# Altium schematic sheet Hexapod_servo_AD.SchDoc
size A4
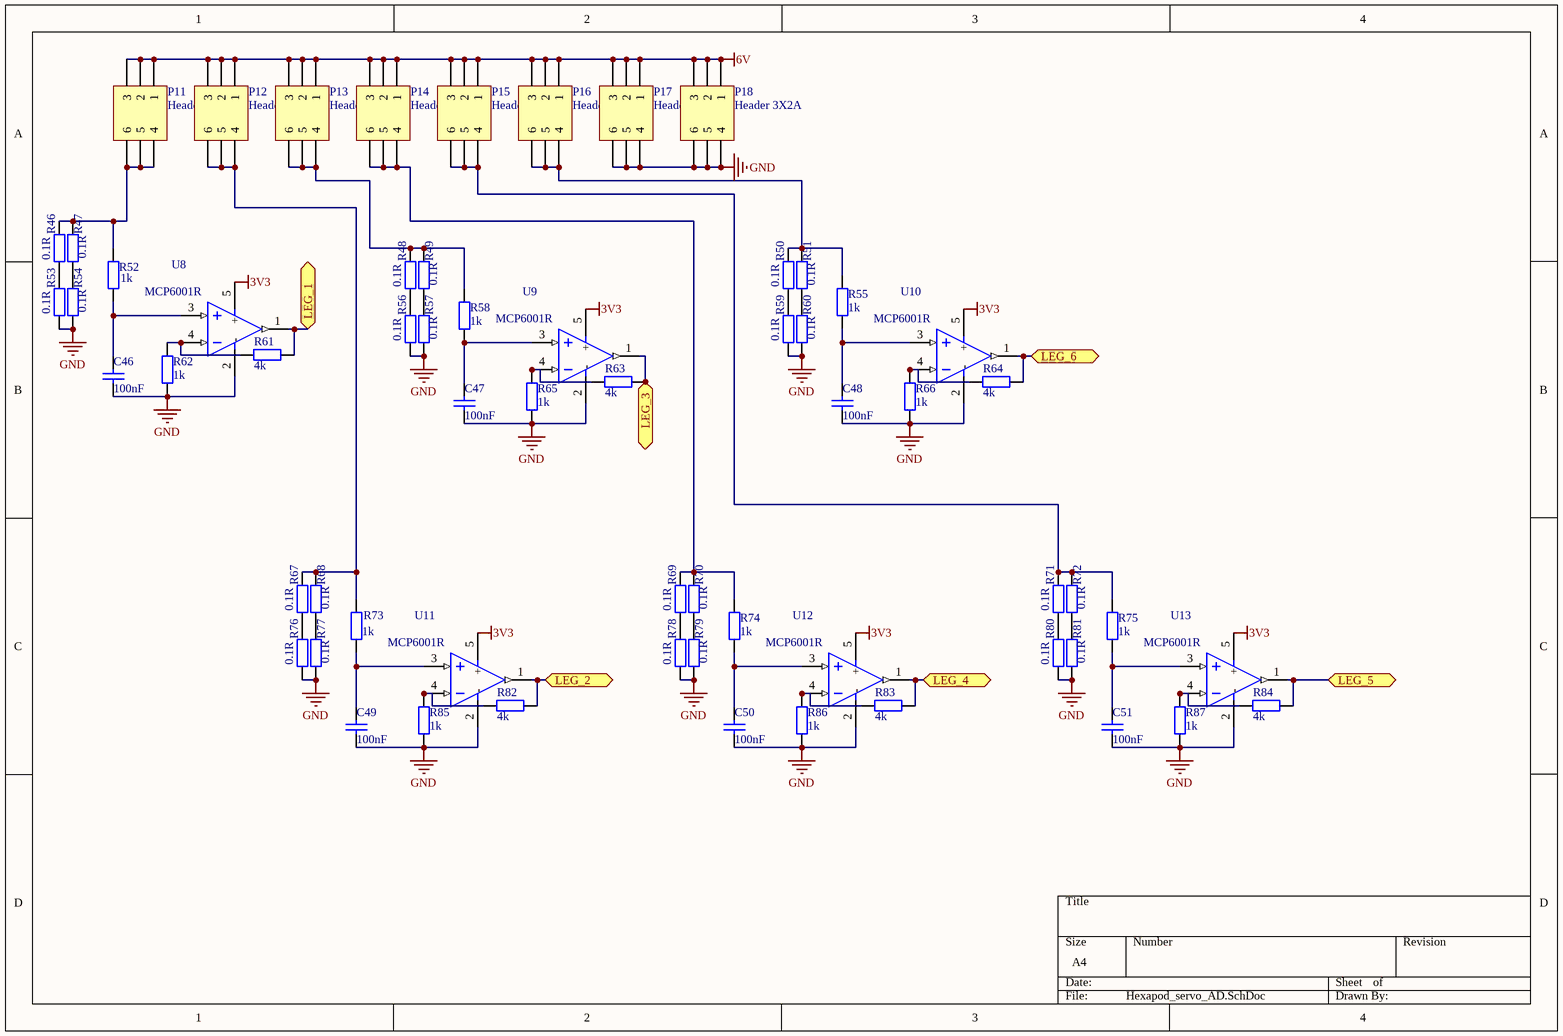
[diagram p0: Hexapod_servo_AD.SchDoc]

## Parts
C46  100nF  [FP_0603_CAP_080]
C47  100nF  [FP_0603_CAP_080]
C48  100nF  [FP_0603_CAP_080]
C49  100nF  [FP_0603_CAP_080]
C50  100nF  [FP_0603_CAP_080]
C51  100nF  [FP_0603_CAP_080]
P11  Header 3X2A  [HDR2X3_CEN]
P12  Header 3X2A  [HDR2X3_CEN]
P13  Header 3X2A  [HDR2X3_CEN]
P14  Header 3X2A  [HDR2X3_CEN]
P15  Header 3X2A  [HDR2X3_CEN]
P16  Header 3X2A  [HDR2X3_CEN]
P17  Header 3X2A  [HDR2X3_CEN]
P18  Header 3X2A  [HDR2X3_CEN]
R46  0.1R  [FP_0603_RES]
R47  0.1R  [FP_0603_RES]
R48  0.1R  [FP_0603_RES]
R49  0.1R  [FP_0603_RES]
R50  0.1R  [FP_0603_RES]
R51  0.1R  [FP_0603_RES]
R52  1k  [FP_0603_RES]
R53  0.1R  [FP_0603_RES]
R54  0.1R  [FP_0603_RES]
R55  1k  [FP_0603_RES]
R56  0.1R  [FP_0603_RES]
R57  0.1R  [FP_0603_RES]
R58  1k  [FP_0603_RES]
R59  0.1R  [FP_0603_RES]
R60  0.1R  [FP_0603_RES]
R61  4k  [FP_0603_RES]
R62  1k  [FP_0603_RES]
R63  4k  [FP_0603_RES]
R64  4k  [FP_0603_RES]
R65  1k  [FP_0603_RES]
R66  1k  [FP_0603_RES]
R67  0.1R  [FP_0603_RES]
R68  0.1R  [FP_0603_RES]
R69  0.1R  [FP_0603_RES]
R70  0.1R  [FP_0603_RES]
R71  0.1R  [FP_0603_RES]
R72  0.1R  [FP_0603_RES]
R73  1k  [FP_0603_RES]
R74  1k  [FP_0603_RES]
R75  1k  [FP_0603_RES]
R76  0.1R  [FP_0603_RES]
R77  0.1R  [FP_0603_RES]
R78  0.1R  [FP_0603_RES]
R79  0.1R  [FP_0603_RES]
R80  0.1R  [FP_0603_RES]
R81  0.1R  [FP_0603_RES]
R82  4k  [FP_0603_RES]
R83  4k  [FP_0603_RES]
R84  4k  [FP_0603_RES]
R85  1k  [FP_0603_RES]
R86  1k  [FP_0603_RES]
R87  1k  [FP_0603_RES]
U8  MCP6001R  [ANALOG_SOT23-5]
U9  MCP6001R  [ANALOG_SOT23-5]
U10  MCP6001R  [ANALOG_SOT23-5]
U11  MCP6001R  [ANALOG_SOT23-5]
U12  MCP6001R  [ANALOG_SOT23-5]
U13  MCP6001R  [ANALOG_SOT23-5]

## Ports
LEG_1, LEG_2, LEG_3, LEG_4, LEG_5, LEG_6

## Nets
3V3: U8.5(+) U9.5(+) U10.5(+) U11.5(+) U12.5(+) U13.5(+)
6V: P11.1 P11.2 P11.3 P12.1 P12.2 P12.3 P13.1 P13.2 P13.3 P14.1 P14.2 P14.3 P15.1 P15.2 P15.3 P16.1 P16.2 P16.3 P17.1 P17.2 P17.3 P18.1 P18.2 P18.3
GND: C46.1 C47.1 C48.1 C49.1 C50.1 C51.1 P17.4 P17.5 P17.6 P18.4 P18.5 P18.6 R53.1 R54.1 R56.1 R57.1 R59.1 R60.1 R62.1 R65.1 R66.1 R76.1 R77.1 R78.1 R79.1 R80.1 R81.1 R85.1 R86.1 R87.1 U8.2(-) U9.2(-) U10.2(-) U11.2(-) U12.2(-) U13.2(-)
LEG_1: R61.2 U8.1(OUT1) ; port LEG_1
LEG_2: R82.2 U11.1(OUT1) ; port LEG_2
LEG_3: R63.2 U9.1(OUT1) ; port LEG_3
LEG_4: R83.2 U12.1(OUT1) ; port LEG_4
LEG_5: R84.2 U13.1(OUT1) ; port LEG_5
LEG_6: R64.2 U10.1(OUT1) ; port LEG_6
NetC46_2: C46.2 R52.1 U8.3(IN1+)
NetC47_2: C47.2 R58.1 U9.3(IN1+)
NetC48_2: C48.2 R55.1 U10.3(IN1+)
NetC49_2: C49.2 R73.1 U11.3(IN1+)
NetC50_2: C50.2 R74.1 U12.3(IN1+)
NetC51_2: C51.2 R75.1 U13.3(IN1+)
NetP11_4: P11.4 P11.5 P11.6 R46.2 R47.2 R52.2
NetP12_4: P12.4 P12.5 P12.6 R67.2 R68.2 R73.2
NetP13_4: P13.4 P13.5 P13.6 R48.2 R49.2 R58.2
NetP14_4: P14.4 P14.5 P14.6 R69.2 R70.2 R74.2
NetP15_4: P15.4 P15.5 P15.6 R71.2 R72.2 R75.2
NetP16_4: P16.4 P16.5 P16.6 R50.2 R51.2 R55.2
NetR46_1: R46.1 R53.2
NetR47_1: R47.1 R54.2
NetR48_1: R48.1 R56.2
NetR49_1: R49.1 R57.2
NetR50_1: R50.1 R59.2
NetR51_1: R51.1 R60.2
NetR61_1: R61.1 R62.2 U8.4(IN1-)
NetR63_1: R63.1 R65.2 U9.4(IN1-)
NetR64_1: R64.1 R66.2 U10.4(IN1-)
NetR67_1: R67.1 R76.2
NetR68_1: R68.1 R77.2
NetR69_1: R69.1 R78.2
NetR70_1: R70.1 R79.2
NetR71_1: R71.1 R80.2
NetR72_1: R72.1 R81.2
NetR82_1: R82.1 R85.2 U11.4(IN1-)
NetR83_1: R83.1 R86.2 U12.4(IN1-)
NetR84_1: R84.1 R87.2 U13.4(IN1-)

## Library data of the parts
C46-C51 = Cap: Capacitor; Value: 100pF; Published: 8-Jun-2000; LatestRevisionDate: 17-Jul-2002; LatestRevisionNote: Re-released for DXP Platform.; PackageReference: RAD-0.3; Publisher: Altium Limited
P11-P18 = Header 3X2A: Header, 3-Pin, Dual row; LatestRevisionDate: 17-Jul-2002; LatestRevisionNote: Re-released for DXP Platform.; Publisher: Altium Limited
R46-R51 R53 R54 R56 R57 R59-R61 R63 R64 R67-R72 R76-R84 = Res3: Resistor; Value: 1k; Published: 8-Jun-2000; LatestRevisionDate: 04-Mar-2005; LatestRevisionNote: PCB Footprint replaced.; PackageReference: J1-0603; Publisher: Altium Limited
R52 R55 R58 R62 R65 R66 R73-R75 R85-R87 = Res3: Resistor; Published: 8-Jun-2000; LatestRevisionDate: 04-Mar-2005; LatestRevisionNote: PCB Footprint replaced.; PackageReference: J1-0603; Publisher: Altium Limited; Value: 1k